# EAGLE design Adafruit PowerBoost 1000 Basic (EAGLE 6.3)
COMPANY: ADAFRUIT INDUSTRIES; DRAWN: KTOWN; REV: A
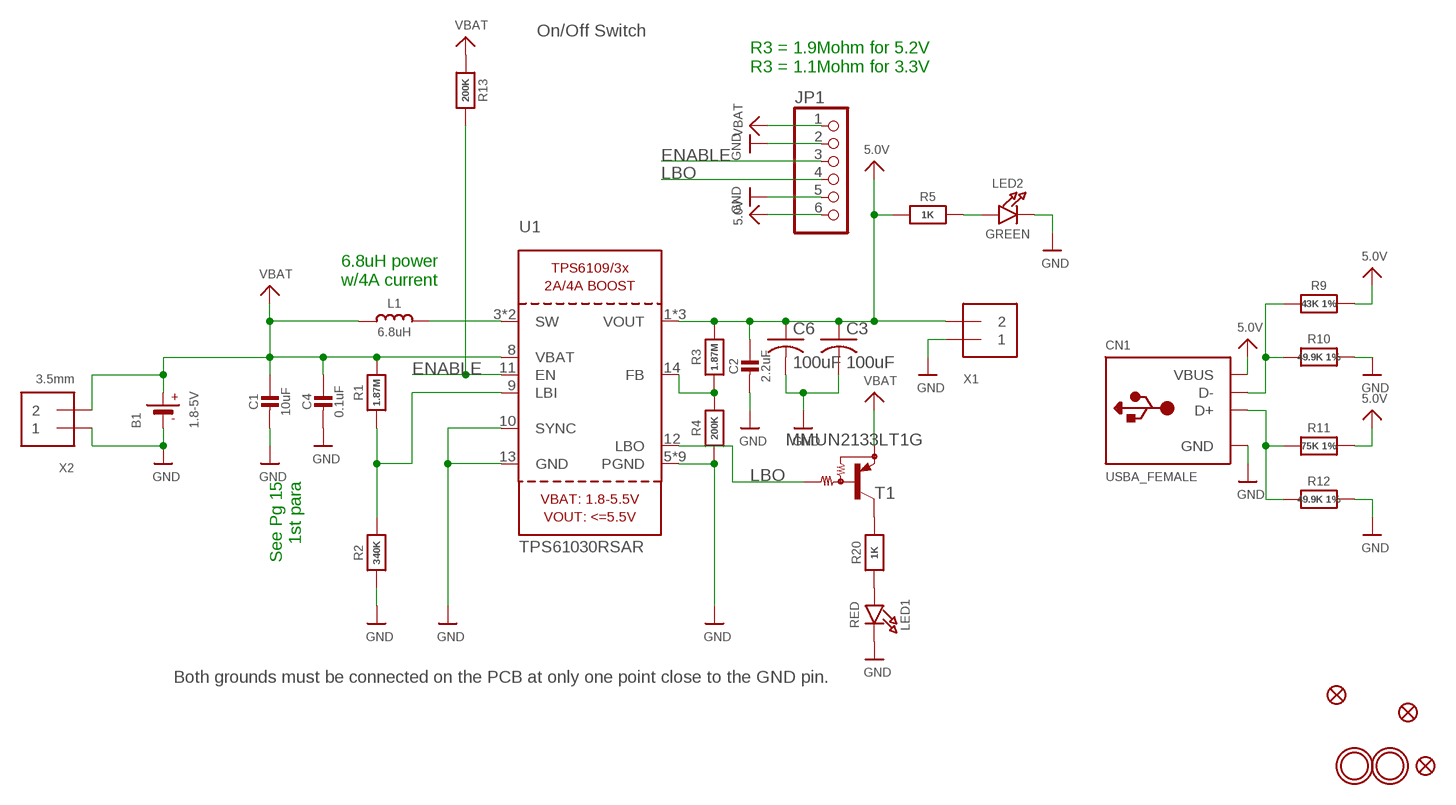
[diagram p0: schematic, sheet 1]

## Parts
B1  1.8-5V  BATTERY  [JSTPH2]
C1  10uF  CAP_CERAMIC0805-NOOUTLINE  [0805-NO]
C2  2.2uF  CAP_CERAMIC0805-NOOUTLINE  [0805-NO]
C3  100uF  C-USC1210  [C1210]
C4  0.1uF  CAP_CERAMIC0805-NOOUTLINE  [0805-NO]
C6  100uF  C-USC1210  [C1210]
CN1  USBA_FEMALE  USB_TYPEAPTHFML  [USB_HOST-PTH]
FID1  FIDUCIAL""  [FIDUCIAL_1MM]
FID2  FIDUCIAL""  [FIDUCIAL_1MM]
FID3  FIDUCIAL""  [FIDUCIAL_1MM]
JP1  PINHD-1X6CB  [1X06-CLEANBIG]
L1  6.8uH  INDUCTOR-8X8  [INDUCTOR_8X8MM]
LED1  RED  LED0805_NOOUTLINE  [CHIPLED_0805_NOOUTLINE]
LED2  GREEN  LED0805_NOOUTLINE  [CHIPLED_0805_NOOUTLINE]
R1  1.87M  RESISTOR_0805MP  [_0805MP]
R2  340K  RESISTOR_0805MP  [_0805MP]
R3  1.87M  RESISTOR_0805MP  [_0805MP]
R4  200K  RESISTOR0805_NOOUTLINE  [0805-NO]
R5  1K  RESISTOR0805_NOOUTLINE  [0805-NO]
R9  43K 1%  RESISTOR0805_NOOUTLINE  [0805-NO]
R10  49.9K 1%  RESISTOR0805_NOOUTLINE  [0805-NO]
R11  75K 1%  RESISTOR0805_NOOUTLINE  [0805-NO]
R12  49.9K 1%  RESISTOR0805_NOOUTLINE  [0805-NO]
R13  200K  RESISTOR0805_NOOUTLINE  [0805-NO]
R20  1K  RESISTOR0805_NOOUTLINE  [0805-NO]
T1  MMUN2133LT1G  MUN2114T1-PNP_DRIVER-SC59-BEC  [SC59-BEC]
U1  TPS61030RSAR  VREG_TPS6103X  [PVQFN-16]
U$10  MOUNTINGHOLE2.5  [MOUNTINGHOLE_2.5_PLATED]
U$11  MOUNTINGHOLE2.5  [MOUNTINGHOLE_2.5_PLATED]
X1  TERMBLOCK_1X2  [TERMBLOCK_1X2-3.5MM]
X2  3.5mm  TERMBLOCK_1X2  [TERMBLOCK_1X2-3.5MM]

## Nets
5.0V: C2.1 C3.1 C6.1 CN1.VBUS JP1.6 R3.2 R5.1 R9.2 R11.2 U1.1(VOUT) U1.15(VOUT) U1.16(VOUT) X1.2
D+: CN1.D+ R11.1 R12.1
D-: CN1.D- R9.1 R10.1
ENABLE: JP1.3 R13.2 U1.11(EN)
GND: B1.1(-) C1.2 C2.2 C3.2 C4.2 C6.2 CN1.GND JP1.2 JP1.5 LED1.C LED2.C R2.1 R4.1 R10.2 R12.2 U1.5(PGND) U1.6(PGND) U1.7(PGND) U1.10(SYNC) U1.13(GND) U1.P$18(PGND) U1.P$19(PGND) U1.P$20(PGND) U1.P$21(PGND) U1.P$22(PGND) U1.THERMAL(PGND) X1.1 X2.1
LBO: JP1.4 T1.B U1.12(LBO)
N$1: L1.P$2 U1.3(SW) U1.4(SW)
N$2: LED1.A R20.1
N$3: R1.1 R2.2 U1.9(LBI)
N$4: LED2.A R5.2
N$5: R3.1 R4.2 U1.14(FB)
N$6: R20.2 T1.C
VBAT: B1.2(+) C1.1 C4.1 JP1.1 L1.P$1 R1.2 R13.1 T1.E U1.8(VBAT) X2.2

## Notes on the sheet
- On/Off Switch
- R3 = 1.9Mohm for 5.2V
  R3 = 1.1Mohm for 3.3V
- 6.8uH power
  w/4A current
- See Pg 15
  1st para
- Both grounds must be connected on the PCB at only one point close to the GND pin.

## Library data of the parts
B1 = microbuilder:BATTERY: CR1220 SMT - Digikey: 3001K-ND CD2032 BAT-HLD-001 - Digikey: BAT-HLD-001-ND
C1 C2 C4 = microbuilder:CAP_CERAMIC: Ceramic Capacitors For new designs, use the packages preceded by an '_' character since they are more reliable: The following footprints should be used on most boards: _0402 - Standard footprint for regular board layouts _0603 - Standard footprint for regular board layouts _0805 - Standard footprint for regular board layouts _1206 - Standard footprint for regular board layouts For extremely tight-pitch boards where space is at a premium, the following 'micro-pitch' footprints can be used (smaller pads, no silkscreen outline, etc.): _0402MP - Micro-pitch footprint for very dense/compact boards _0603MP - Micro-pitch footprint for very dense/compact boards _0805MP - Micro-pitch footprint for very dense/compact boards _1206MP - Micro-pitch footprint for very dense/compact boards
C3 C6 = rcl:C-US: CAPACITOR, American symbol
CN1 = microbuilder:USB_TYPEA: USB - Type A Connectors Male types stick out and are inserted into a PC or matching females parts (these are the connectors used on USB Memory Sticks, etc.). Female parts are generally used for USB Host and accept a male-type connector. SMT - 4UCON: 10017 PTHFML - Digikey: 609-1045-ND, 4UCon: 05241 PCB - Use 2.0mm thick PCBs with this footprint
FID1-FID3 = microbuilder:FIDUCIAL: Fiducial Alignment Points Various fiducial points for machine vision alignment.; BOM: EXCLUDE
JP1 = adafruit:PINHD-1X6: PIN HEADER
L1 = microbuilder:INDUCTOR: Inductors 0603: 10nH Ceramic Inductor - microwire antenna/RF (Digikey: 712-1434-2-ND) 0805: 560nH Ceramic Inductor - RF (Digikey: 553-1047-1-ND) 270nH Ceramic Inductor - Q = 40@250MHz, +-5%, 1 Ohm DC Resistance (Digikey: 535-10506-2-ND) 1007 (2518 Metric) SMT: 10µH 10% 250mOhm 820mA 1007 Inductor (Digikey: 587-2189-1-ND) 22µH 10% 500mOhm 580mA 1007 Inductor (Digikey: 587-2190-1-ND) 47µH 10% 950mOhm 420mA 1007 Inductor (Digikey: 587-2191-1-ND) 47µH 5% 100mOhm 1A 1008 Inductor (Digikey: 732-1816-1-ND) 5.0x5.0mm (Taiyo Yuden NR5040 Series) 6.8µH 20% 2.3A 64mOhm Inductor (Digikey: 587-2374-2-ND) 5.0x5.0mm (TDK VLC5045 Series) 4.7µH 20% 3.3A 34mOhm Inductor (Digikey: 445-6526-1-ND) 6.8µH 20% 2.7A 46mOhm Inductor (Digikey: 445-6527-1-ND) 6.0x6.0mm (TDK VLC6045 Series) 4.7µH 20% 3.8A 27mOhm Inductor (Digikey: 445-6538-2-ND) 6.8µH 20% 3A 41mOhm Inductor (Digikey: 445-6540-1-ND) 6.2µH 30% 2.2A 45mOhm Inductor (Digikey: SRR5028-6R2YCT-ND) - Not TDK VLC6045 but footprint should match 6.0x6.0mm (TDK SLF6045 Series) 6.8uH 30% 2A 33mOhm Inductor (Digikey: 445-4572-1-ND, Mouser: 810-SLF645T6R8N2R0PF) 6.0x6.0mm (Sumida CDRH5D28 Series) 6.2uH 30% 1.8A 45mOhm Inductor (Digikey: 308-1542-1-ND) Taiyo Yuden NR3015T2R2M - 2.2uH 20% 1.5A (Digikey: 587-1648-2-ND, Mouser: 963-NR3015T2R2M) - Used with TI TPS62172 CoilCraft RFID Transponder Coil - MA5532-AE (For use with AS3935 Lightning Sensor) Vishay IHLP 1.0uH Molded Inductor - 24mOhm DCR, 5A, +/-20%, -55°C-125°C (Digikey: 541-1319-1-ND)
LED1 LED2 = microbuilder:LED: LED 0603 - 0603 Surface Mount Package 2mA: Green LED - Low Power (3.9mcd, 2ma, 1.7Vf) - Digikey: 475-2709-2-ND Orange LED - Low Power (9.8mcd, 2ma, 1.8Vf) - Digikey: 475-1194-2-ND Red LED - Low Power (5mcd, 2ma, 1.8Vf) - Digikey: 475-1195-2-ND Yellow LED - Low Power (7mcd, 2ma, 1.8Vf) - Digikey: 475-1196-2-ND 5mA: Blue LED - Low Power (17mcd, 5ma, 2.9Vf) - Digikey: LNJ937W8CRACT-ND 0805 - 0805 Surface Mount Package 2mA: Red LED (8.8mcd, 2mA, 1.8Vf, Clear) - Low Power [Digikey: 475-2510-1-ND] Green LED (5mcd, 2mA, 1.8Vf, Clear) - Low Power [Digikey: 475-2730-1-ND] Yellow LED (11.3mcd, 2mA, 1.8Vf, Clear) - Low Power [Digikey: 475-2555-1-ND] 20mA: Red LED (104mcd, 20mA, Diffused) - LS R976 [Digikey: 475-1278-6-ND] Red LED (12mcd, 20mA, 2.0Vf, Clear) - APT2012EC [Digikey: 754-1128-1-ND] Green LED (15mcd, 20mA, 2.2Vf, Clear) - APT2012GC [Digikey: 754-1131-1-ND] Orange LED (160mcd, 20mA, 2.1Vf, Clear) - APT2012SECK [Digikey: 754-1130-1-ND] 1206 - 1206 Surface Mount Package Green LED (26mcd, 20mA, Diffused) - LG N971 [Digikey: 475-1407-6-ND] Red LED (15mcd, 20mA, Diffused) - LH N974 [Digikey: 475-1416-6-ND] Cree - Cree High-Power Surface Mount LEDs XPEBWT-L1-0000-00D50 - White 111lm 350mA 2.9Vf 6200K 110° XTEAWT-00-0000-00000LEE3 - White 114lm 350mA 2.85Vf 5000K 115° Everlight - Everlight 45-21 Series Surface Mount LEDs 45-21/QK2C-B2832AC2CB2/2T - Warm White 2000mcd 20mA 3.25Vf 3050K 120° 45-21/LK2C-B38452C4CB2/2T - Nuetral White 2000mcd 20mA 3.25Vf 4150K 120° 45-21/LK2C-B50634C6CB2/2T - Cold White 2200mcd 20mA 3.25Vf 5650K 120° PLCC2 Reverse Mount LS T77K-J1L2-1-0-2-R18-Z - Red 11.25mcd 2mA 1.8Vf 630nm 120° LO T77K-L1M2-24-Z - Orange 19.6mcd 2mA 1.8Vf 606nm 120° LY T77K-K2M1-26-Z - Yellow 15.7mcd 2mA 1.8Vf 587nm 120°
R1-R5 R9-R13 R20 = microbuilder:RESISTOR: Resistors For new designs, use the packages preceded by an '_' character since they are more reliable: The following footprints should be used on most boards: _0402 - Standard footprint for regular board layouts _0603 - Standard footprint for regular board layouts _0805 - Standard footprint for regular board layouts _1206 - Standard footprint for regular board layouts For extremely tight-pitch boards where space is at a premium, the following 'micro-pitch' footprints can be used (smaller pads, no silkscreen outline, etc.): _0402MP - Micro-pitch footprint for very dense/compact boards _0603MP - Micro-pitch footprint for very dense/compact boards _0805MP - Micro-pitch footprint for very dense/compact boards _1206MP - Micro-pitch footprint for very dense/compact boards
T1 = transistor:*-PNP_DRIVER-: PNP Bias Resistor Transistor
U1 = microbuilder:VREG_TPS6103X: TPS6103x 4A Boost - 1.8-5.5V Input, Adjustable Output to 5.5V
U$10 U$11 = microbuilder:MOUNTINGHOLE: Mounting Hole For #2 screws (0.086"/2.18mm width, 0.094"/2.4mm hole) use 2.5mm; BOM: EXCLUDE
X1 X2 = microbuilder:TERMBLOCK_1X2: 3.5mm Terminal block http://www.ladyada.net/library/pcb/eaglelibrary.html

## Board
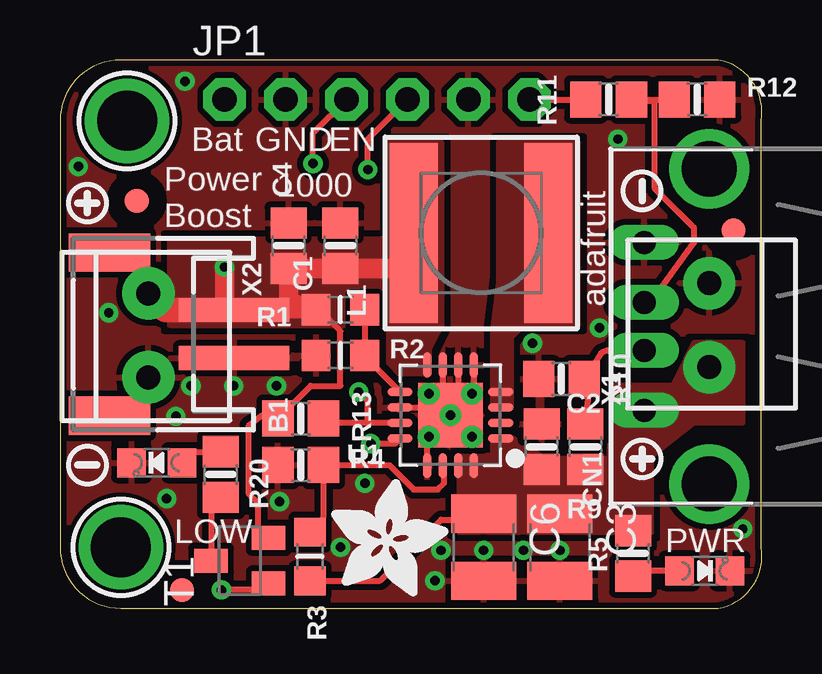
[diagram p1: board, top side]
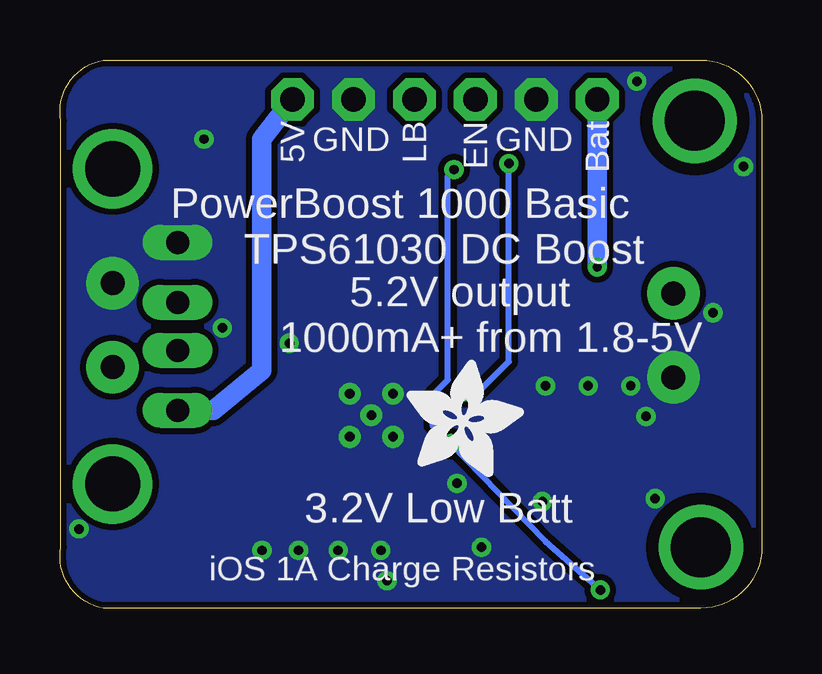
[diagram p2: board, bottom side, seen from below]

Size 29.24 x 22.86 mm. Coordinates in mm from the lower left corner, seen from the top.
Outline: 0,20.32 0,2.54 arc90 2.54,0 27.43,0 arc90 29.21,2.54 29.21,20.32 arc90 27.43,22.86 2.54,22.86 arc90 0,20.32
Copper layers (1*16): Top 0.035mm / dielectric 1.5mm / Bottom 0.035mm
Design rules "adafruit": minimum track width 8mil, minimum drill 15.5mil, track to track 8mil, track to pad 8mil, pad to pad 8mil, via to via 8mil, smd to smd 8mil, copper to edge 10mil, drill to drill 8mil, minimum pad ring 10mil, minimum via ring 8mil, stop-mask expansion 2mil, vias tented up to drill 20mil, thermal gap 10mil
tRestrict: area 16.2,9.9 to 16.3,10.4; area 16.9,9.9 to 17,10.4; area 14.8,5.7 to 14.9,6.2

### Footprints (pad centres in the part's own frame; a part is rotated, then mirrored left to right if it is on the bottom)
JSTPH2 = smd 1 x 4.6: 1 -1,-3.7; 2 1,-3.7 | smd 1.6 x 3.4: NC1 -3.4,1.5; NC2 3.4,1.5
0805-NO = smd 1.3 x 1.5: 1 -0.95,0; 2 0.95,0
C1210 = smd 1.6 x 2.7: 1 -1.4,0; 2 1.4,0
USB_HOST-PTH = drill 0.95 long: D+ 1,6.52; D- -1,6.52; GND 3.5,6.52; VBUS -3.5,6.52 | drill 2.3 pad 2.9: S1 -6.57,3.81; S2 6.57,3.81
FIDUCIAL_1MM = smd 1 x 1: 1 0,0
1X06-CLEANBIG = drill 1.016 pad 1.778 octagon: 1 -6.35,0; 2 -3.81,0; 3 -1.27,0; 4 1.27,0; 5 3.81,0; 6 6.35,0
INDUCTOR_8X8MM = smd 2 x 7.5: P$1 -2.8,0; P$2 2.8,0
CHIPLED_0805_NOOUTLINE = smd 1.2 x 1.2: A 0,-1.05; C 0,1.05
_0805MP = smd 1.2 x 1.3: 1 -1.016,0; 2 1.016,0
SC59-BEC = smd 1 x 1.4: B -0.95,-1.2; C 0,1.2; E 0.95,-1.2
PVQFN-16 = smd 1.05 x 0.35: 1 -2.1,0.975; 2 -2.1,0.325; 3 -2.1,-0.325; 4 -2.1,-0.975; 9 2.1,-0.975; 10 2.1,-0.325; 11 2.1,0.325; 12 2.1,0.975 | smd 0.35 x 1.05: 5 -0.975,-2.1; 6 -0.325,-2.1; 7 0.325,-2.1; 8 0.975,-2.1; 13 0.975,2.1; 14 0.325,2.1; 15 -0.325,2.1; 16 -0.975,2.1 | drill 0.4: P$18 0,0; P$19 -0.9,0.9; P$20 0.9,0.9; P$21 0.9,-0.9; P$22 -0.9,-0.9 | smd 2.7 x 2.7: THERMAL 0,0
MOUNTINGHOLE_2.5_PLATED = drill 2.5 pad 3.2: P$1 0,0
TERMBLOCK_1X2-3.5MM = drill 1 pad 2.184: 1 1.8,0; 2 -1.7,0

### Placement (x,y rotation side)
B1  3.56,11.43 90 top
C1  11.68,15.11 90 top
C2  20.07,6.73 90 top
C3  20.83,2.54 270 top
C4  9.53,15.11 90 top
C6  17.65,2.54 270 top
CN1  30.86,11.75 90 top
FID1  28.07,15.75 0 top
FID2  3.2,16.99 0 top
FID3  5.08,0.76 0 top
JP1  13.21,21.21 0 top
L1  17.54,15.65 0 top
LED1  4.03,6.06 90 top
LED2  26.86,1.56 270 top
R1  11.68,12.45 180 top
R2  11.68,10.54 0 top
R3  10.41,2.16 270 top
R4  10.03,5.97 0 top
R5  23.88,2.29 270 top
R9  21.89,6.73 270 top
R10  20.89,9.56 180 top
R11  22.86,21.21 180 top
R12  26.54,21.21 0 top
R13  10.03,7.91 0 top
R20  6.7,5.57 270 top
T1  7.49,1.98 90 top
U1  16.27,8.05 180 top
U$10  2.79,20.32 0 top
U$11  2.54,2.54 0 top
U$12  [SYMBOL_MINUS]  1.14,5.97 0 top
U$13  [SYMBOL_PLUS]  1.14,16.89 0 top
U$25  [SYMBOL_PLUS]  24.26,6.22 0 top
U$26  [SYMBOL_MINUS]  24.26,17.4 90 top
U$28  [ADAFRUIT_5MM]  14.79,5.48 0 bottom
U$33  [ADAFRUIT_5MM]  11.3,0.51 0 top
X1  27.05,11.75 90 top
X2  3.68,11.43 270 top

### Tracks (layer width: path | path; a pad name or v marks a point on that pad's centre or on a via)
5.0V
  Top 0.254: 23.5,8.38 25.27,8.38 25.14,8.25 CN1.VBUS | JP1.6 R11.2 | R3.2 13.34,1.14 15.88,3.68 17.4,3.68 C6.1
  Bottom 0.813: JP1.6 20.83,19.56 20.83,9.91 22.87,8.25 CN1.VBUS
  pour Top (isolate 0.254, no thermals): 16.64,6.35 16.64,3.17 24.64,3.17 24.64,6.35 26.42,7.75 28.45,7.75 28.45,11.05 26.42,11.05 25.53,9.27 23.11,9.27 22.86,6.22 20.19,6.22 18.8,7.11 18.03,7.11 18.03,6.35
D+
  Top 0.254: R12.1 R11.1 24.77,21.14 24.77,17.53 26.42,15.88 26.42,15.24 24.72,12.91 CN1.D+
D-
  Top 0.254: CN1.D- 22.8,10.75 22.54,10.64 R10.1 22.15,9.89 R9.1
ENABLE  (via drill 0.39)
  Top 0.254: U1.11 12.83,7.72 | 12.83,7.72 11.17,7.72 R13.2 | 12.83,7.72 12.83,8.64 v12.45,9.02 | v10.54,18.54 10.54,19.81 JP1.3
  Bottom 0.254: v12.45,9.02 11.81,9.02 10.54,10.29 v10.54,18.54
GND  (via drill 0.39)
  Top 0.254: U1.13 15.29,6.91 15.49,7.11 15.4,7.11 U1.P$20 | U1.10 15.61,8.37 15.62,8.38 15.37,8.63 U1.P$21 15.44,9.02 15.88,9.02 15.95,9.09 U1.7 | U1.6 16.59,8.8 16.76,8.64 | U1.5 17.25,9.02 U1.P$22
  other vias: 12.7,5.21 23.24,19.56 0.76,18.41 7.24,9.27 5.46,9.27 9.02,9.27 22.48,11.68 20.83,2.41 9.14,4.45 19.3,2.41 17.65,2.41 15.88,2.41 15.62,1.14 28.45,3.3 4.45,4.57 11.68,2.54 5.21,21.97 2.03,12.32 4.83,8 19.68,11.05
  pour Top (isolate 0.254, rank 2): 0,0 0,22.73 29.21,22.73 29.21,0
  pour Bottom (isolate 0.254, no thermals): 0,22.99 29.21,22.99 29.21,0.25 0,0.25
LBO  (via drill 0.39)
  Top 0.254: U1.12 13.96,6.86 v12.95,6.86 | T1.B 8.42,0.76 v6.73,0.76 | v12.83,18.29 12.83,19.56 JP1.4
  Bottom 0.254: v6.73,0.76 9.02,2.79 v12.95,6.86 13.72,7.62 13.72,8.89 13.08,9.53 13.08,18.03 v12.83,18.29
N$1
  pour Top (isolate 0.254, no thermals): 18.03,8.38 18.8,8.38 18.8,11.3 19.3,11.81 21.59,11.81 21.59,19.43 18.29,19.43 18.29,13.59 18.03,11.56
N$2
  Top 0.254: LED1.A 5.16,6.52 R20.1
N$3
  Top 0.254: R1.1 R2.2 13.02,10.18 U1.9
N$4
  Top 0.254: LED2.A 24.16,1.56 R5.2
N$5
  Top 0.254: U1.14 16,5.89 16,5.21 15.75,4.95 14.73,4.95 13.72,5.97 R4.2 10.98,3.81 R3.1
N$6
  Top 0.254: R20.2 6.29,4.27 T1.C
VBAT  (via drill 0.39)
  Top 0.254: T1.E 8.26,3.17 8.26,4.38 7.87,4.77 7.87,7.62 8.41,8.03 R13.1 | R13.1 9.08,8 | R13.1 10.45,9.27 11.68,9.27 11.68,11.56 10.79,12.45 R1.2
  Top 0.813: L1.P$1 14.4,14.16 C1.1 C4.1 9.53,12.77 R1.2 10.43,12.49 B1.2 6.86,12.75 v6.86,14.22
  Top 1.016: X2.2 4.38,12.43 B1.2
  Bottom 0.813: JP1.1 v6.86,14.22
  pour Top (isolate 0.254, no thermals): 15.37,9.78 13.72,9.78 13.72,19.43 15.88,19.43 15.88,11.81 15.37,10.79
  pour Top (no thermals): 4.57,15.37 4.57,11.81 13.59,11.81 13.72,15.37

### Text on the board
tPlace: Bat | GND | EN | 1000 | Power / Boost | adafruit | LOW | PWR
bPlace: Bat | GND | EN | LB | GND | 5V | PowerBoost 1000 Basic | TPS61030 DC Boost | 5.2V output | 1000mA+ from 1.8-5V | 3.2V Low Batt | iOS 1A Charge Resistors